# EAGLE design mixer-board3 (EAGLE 9.6.2)
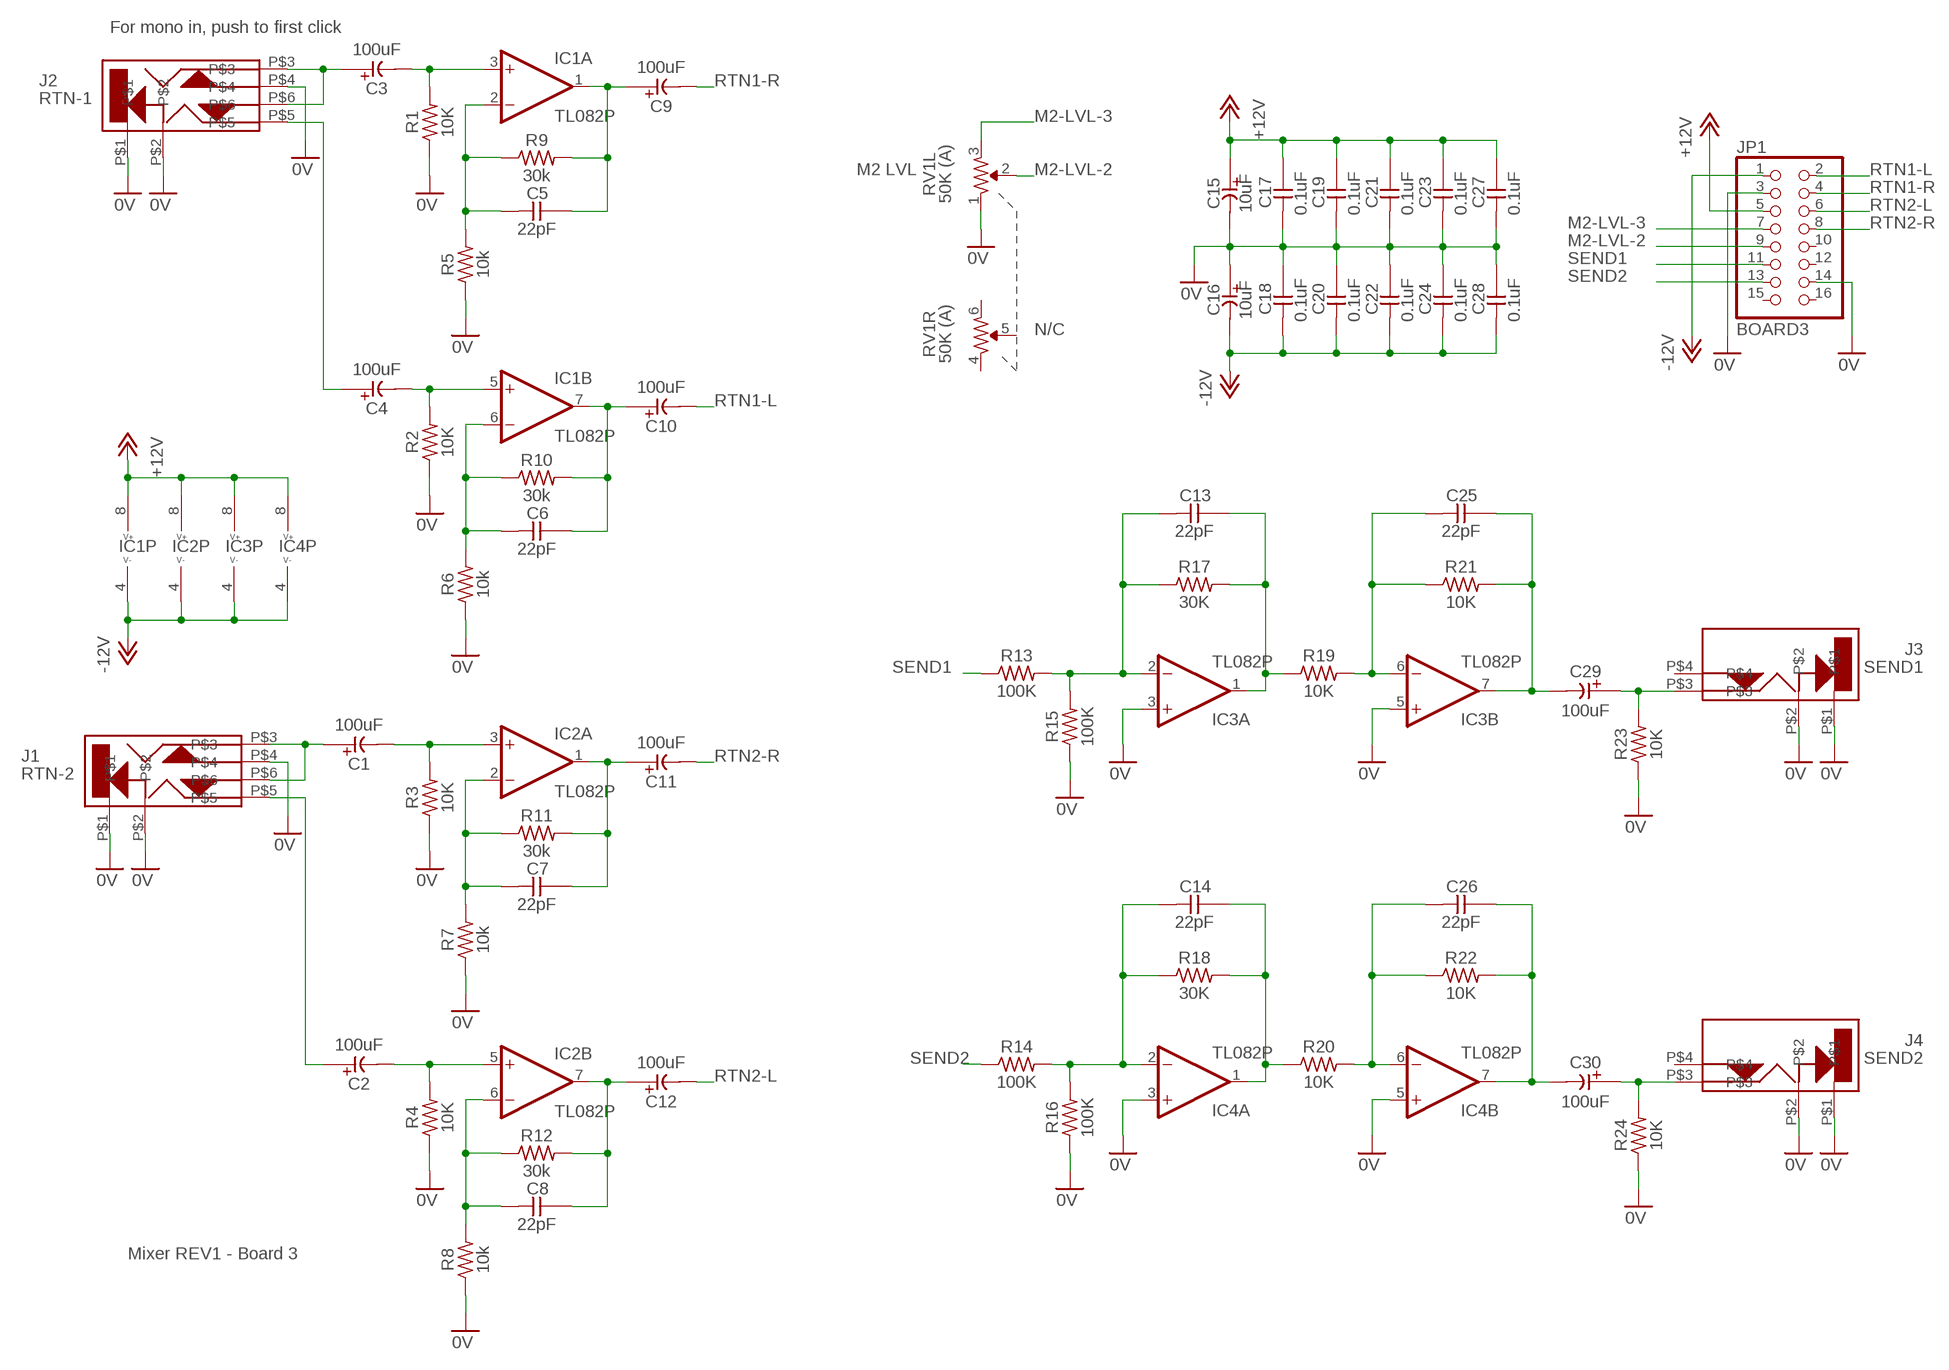
[diagram p0: schematic, sheet 1]

## Parts
C1  100uF  CE-USE5-8.5  [E5-8,5]
C2  100uF  CE-USE5-8.5  [E5-8,5]
C3  100uF  CE-USE5-8.5  [E5-8,5]
C4  100uF  CE-USE5-8.5  [E5-8,5]
C5  22pF  CC-US025-024X044  [C025-024X044]
C6  22pF  CC-US025-024X044  [C025-024X044]
C7  22pF  CC-US025-024X044  [C025-024X044]
C8  22pF  CC-US025-024X044  [C025-024X044]
C9  100uF  CE-USE5-8.5  [E5-8,5]
C10  100uF  CE-USE5-8.5  [E5-8,5]
C11  100uF  CE-USE5-8.5  [E5-8,5]
C12  100uF  CE-USE5-8.5  [E5-8,5]
C13  22pF  CC-US025-024X044  [C025-024X044]
C14  22pF  CC-US025-024X044  [C025-024X044]
C15  10uF  CE-USE2-5  [E2-5]
C16  10uF  CE-USE2-5  [E2-5]
C17  0.1uF  CC-US025-024X044  [C025-024X044]
C18  0.1uF  CC-US025-024X044  [C025-024X044]
C19  0.1uF  CC-US025-024X044  [C025-024X044]
C20  0.1uF  CC-US025-024X044  [C025-024X044]
C21  0.1uF  CC-US025-024X044  [C025-024X044]
C22  0.1uF  CC-US025-024X044  [C025-024X044]
C23  0.1uF  CC-US025-024X044  [C025-024X044]
C24  0.1uF  CC-US025-024X044  [C025-024X044]
C25  22pF  CC-US025-024X044  [C025-024X044]
C26  22pF  CC-US025-024X044  [C025-024X044]
C27  0.1uF  CC-US025-024X044  [C025-024X044]
C28  0.1uF  CC-US025-024X044  [C025-024X044]
C29  100uF  CE-USE5-8.5  [E5-8,5]
C30  100uF  CE-USE5-8.5  [E5-8,5]
IC1  TL082P  [DIL08]
IC2  TL082P  [DIL08]
IC3  TL082P  [DIL08]
IC4  TL082P  [DIL08]
J1  RTN-2  NYS216-U  [NYS216-U]
J2  RTN-1  NYS216-U  [NYS216-U]
J3  SEND1  NYS2162-U  [NYS2162-U]
J4  SEND2  NYS2162-U  [NYS2162-U]
JP1  BOARD3  PINHD-2X8  [2X08]
R1  10K  R  [0207/7]
R2  10K  R  [0207/7]
R3  10K  R  [0207/7]
R4  10K  R  [0207/7]
R5  10k  R  [0207/7]
R6  10k  R  [0207/7]
R7  10k  R  [0207/7]
R8  10k  R  [0207/7]
R9  30k  R  [0207/7]
R10  30k  R  [0207/7]
R11  30k  R  [0207/7]
R12  30k  R  [0207/7]
R13  100K  R  [0207/7]
R14  100K  R  [0207/7]
R15  100K  R  [0207/7]
R16  100K  R  [0207/7]
R17  30K  R  [0207/7]
R18  30K  R  [0207/7]
R19  10K  R  [0207/7]
R20  10K  R  [0207/7]
R21  10K  R  [0207/7]
R22  10K  R  [0207/7]
R23  10K  R  [0207/7]
R24  10K  R  [0207/7]
RV1  50K (A)  R-VAR-ST  [_COMMON_3RP/1610G]

## Nets
0V [power]: C15.- C16.+ C17.2 C18.1 C19.2 C20.1 C21.2 C22.1 C23.2 C24.1 C27.2 C28.1 IC3.3(A:+IN) IC3.5(B:+IN) IC4.3(A:+IN) IC4.5(B:+IN) J1.P$1 J1.P$2 J1.P$4 J2.P$1 J2.P$2 J2.P$4 J3.P$1 J3.P$2 J4.P$1 J4.P$2 JP1.3 JP1.14 R1.1 R2.1 R3.1 R4.1 R5.1 R6.1 R7.1 R8.1 R15.1 R16.1 R23.1 R24.1 RV1.1
+12V [power]: C15.+ C17.1 C19.1 C21.1 C23.1 C27.1 IC1.8(P:V+) IC2.8(P:V+) IC3.8(P:V+) IC4.8(P:V+) JP1.5
-12V [power]: C16.- C18.2 C20.2 C22.2 C24.2 C28.2 IC1.4(P:V-) IC2.4(P:V-) IC3.4(P:V-) IC4.4(P:V-) JP1.1
M2-LVL-2: JP1.9 RV1.2
M2-LVL-3: JP1.7 RV1.3
N$1: C3.+ J2.P$3 J2.P$6
N$2: C4.+ J2.P$5
N$3: C6.2 IC1.6(B:-IN) R6.2 R10.1
N$4: C6.1 C10.+ IC1.7(B:OUT) R10.2
N$6: C3.- IC1.3(A:+IN) R1.2
N$7: C5.2 IC1.2(A:-IN) R5.2 R9.1
N$9: C5.1 C9.+ IC1.1(A:OUT) R9.2
N$10: C4.- IC1.5(B:+IN) R2.2
N$13: C7.2 IC2.2(A:-IN) R7.2 R11.1
N$14: C7.1 C11.+ IC2.1(A:OUT) R11.2
N$15: C1.- IC2.3(A:+IN) R3.2
N$16: C2.- IC2.5(B:+IN) R4.2
N$17: C8.2 IC2.6(B:-IN) R8.2 R12.1
N$18: C8.1 C12.+ IC2.7(B:OUT) R12.2
N$19: C1.+ J1.P$3 J1.P$6
N$20: C2.+ J1.P$5
N$21: C13.2 IC3.2(A:-IN) R13.2 R15.2 R17.1
N$22: C13.1 IC3.1(A:OUT) R17.2 R19.1
N$23: C25.2 IC3.6(B:-IN) R19.2 R21.1
N$24: C25.1 C29.- IC3.7(B:OUT) R21.2
N$25: C14.2 IC4.2(A:-IN) R14.2 R16.2 R18.1
N$26: C14.1 IC4.1(A:OUT) R18.2 R20.1
N$27: C26.2 IC4.6(B:-IN) R20.2 R22.1
N$28: C26.1 C30.- IC4.7(B:OUT) R22.2
OUT-LVL-1: C30.+ J4.P$3 R24.2
OUT-LVL-6: C29.+ J3.P$3 R23.2
RTN1-L: C10.- JP1.2
RTN1-R: C9.- JP1.4
RTN2-L: C12.- JP1.6
RTN2-R: C11.- JP1.8
SEND1: JP1.11 R13.1
SEND2: JP1.13 R14.1
Unconnected: J3.P$4 J4.P$4 JP1.10 JP1.12 JP1.15 JP1.16 RV1.4 RV1.5 RV1.6

## Notes on the sheet
- For mono in, push to first click
- M2 LVL
- N/C
- Mixer REV1 - Board 3

## Library data of the parts
C1-C4 C9-C12 C29 C30 = _common:CE-US: ELECTROLYTIC CAPACITOR, US symbol
C5-C8 C13 C14 C25 C26 = _common:CC-US: CAPACITOR, US symbol
C15 C16 = _common.v1:CE-US: ELECTROLYTIC CAPACITOR, US symbol
C17-C24 C27 C28 = _common.v1:CC-US: CAPACITOR, US symbol
IC1-IC4 = _common:TL082: OP AMP
J1 J2 = jacks:NYS216-U: https://www.mouser.ca/ProductDetail/REAN/NYS216-U Stereo (TRS) 1/4" Jack
J3 J4 = jacks:NYS2162-U: https://www.mouser.ca/ProductDetail/REAN/NYS2162-U Mono (TS) 1/4" Jack
JP1 = pinhead:PINHD-2X8: PIN HEADER
R1-R24 = _common:R: RESISTOR, US symbol
RV1 = _common:R-VAR-ST

## Net classes
0 default: width 0.305 mm, clearance 0.305 mm
1 power: width 0.711 mm, clearance 0.305 mm

## Board
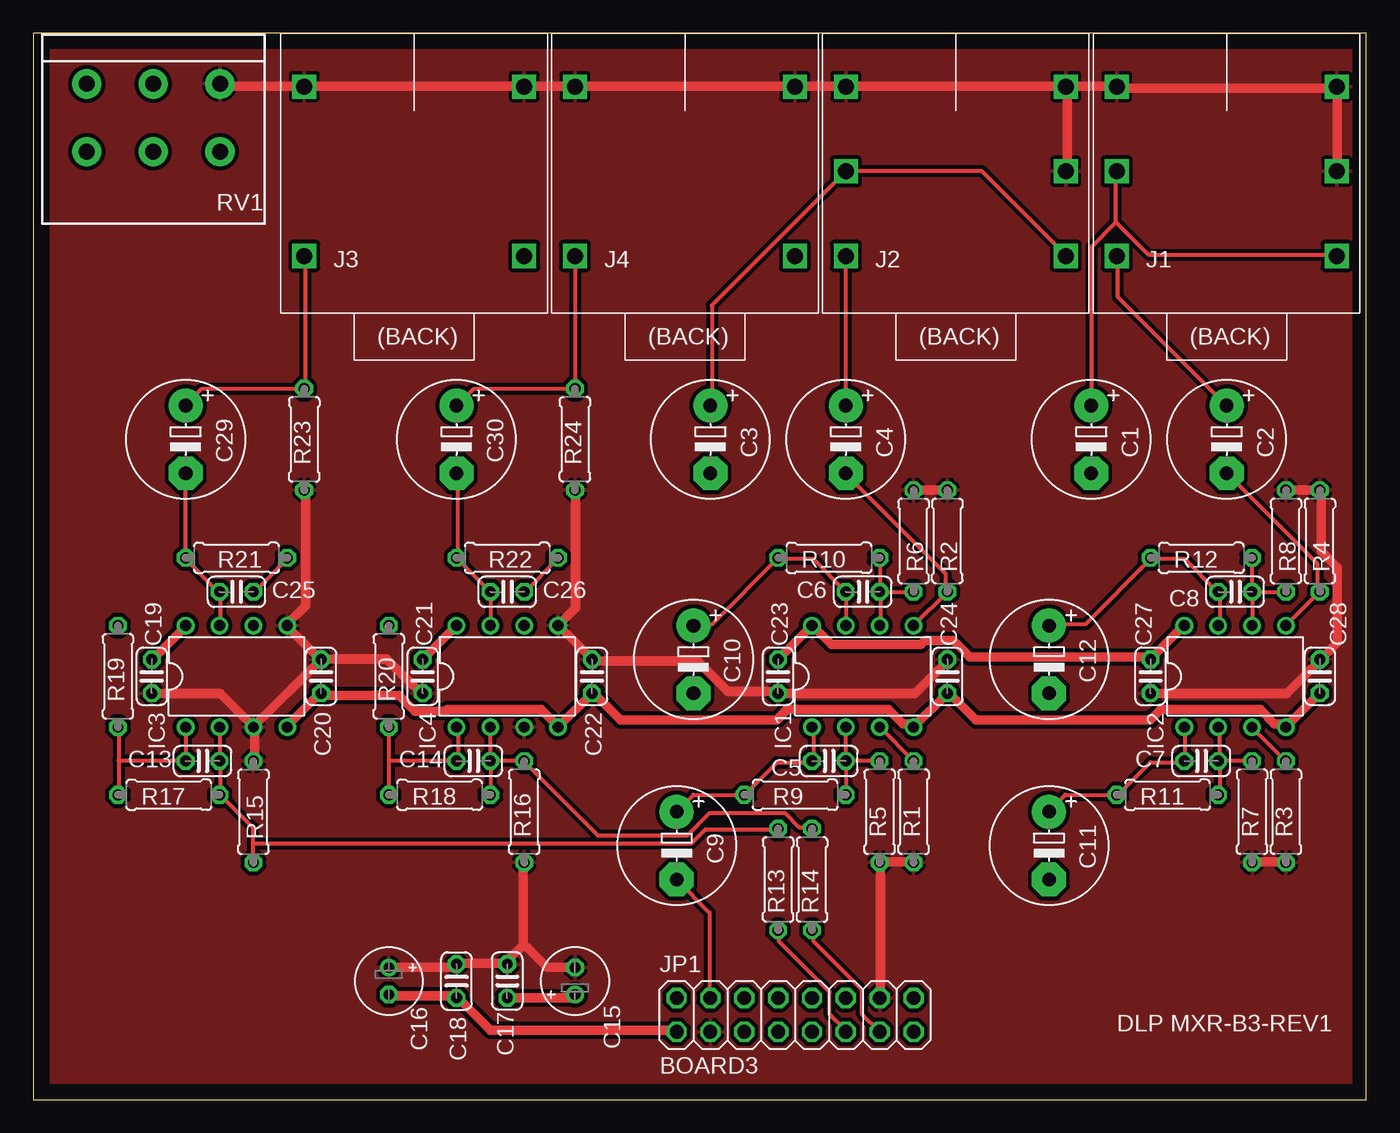
[diagram p1: board, top side]
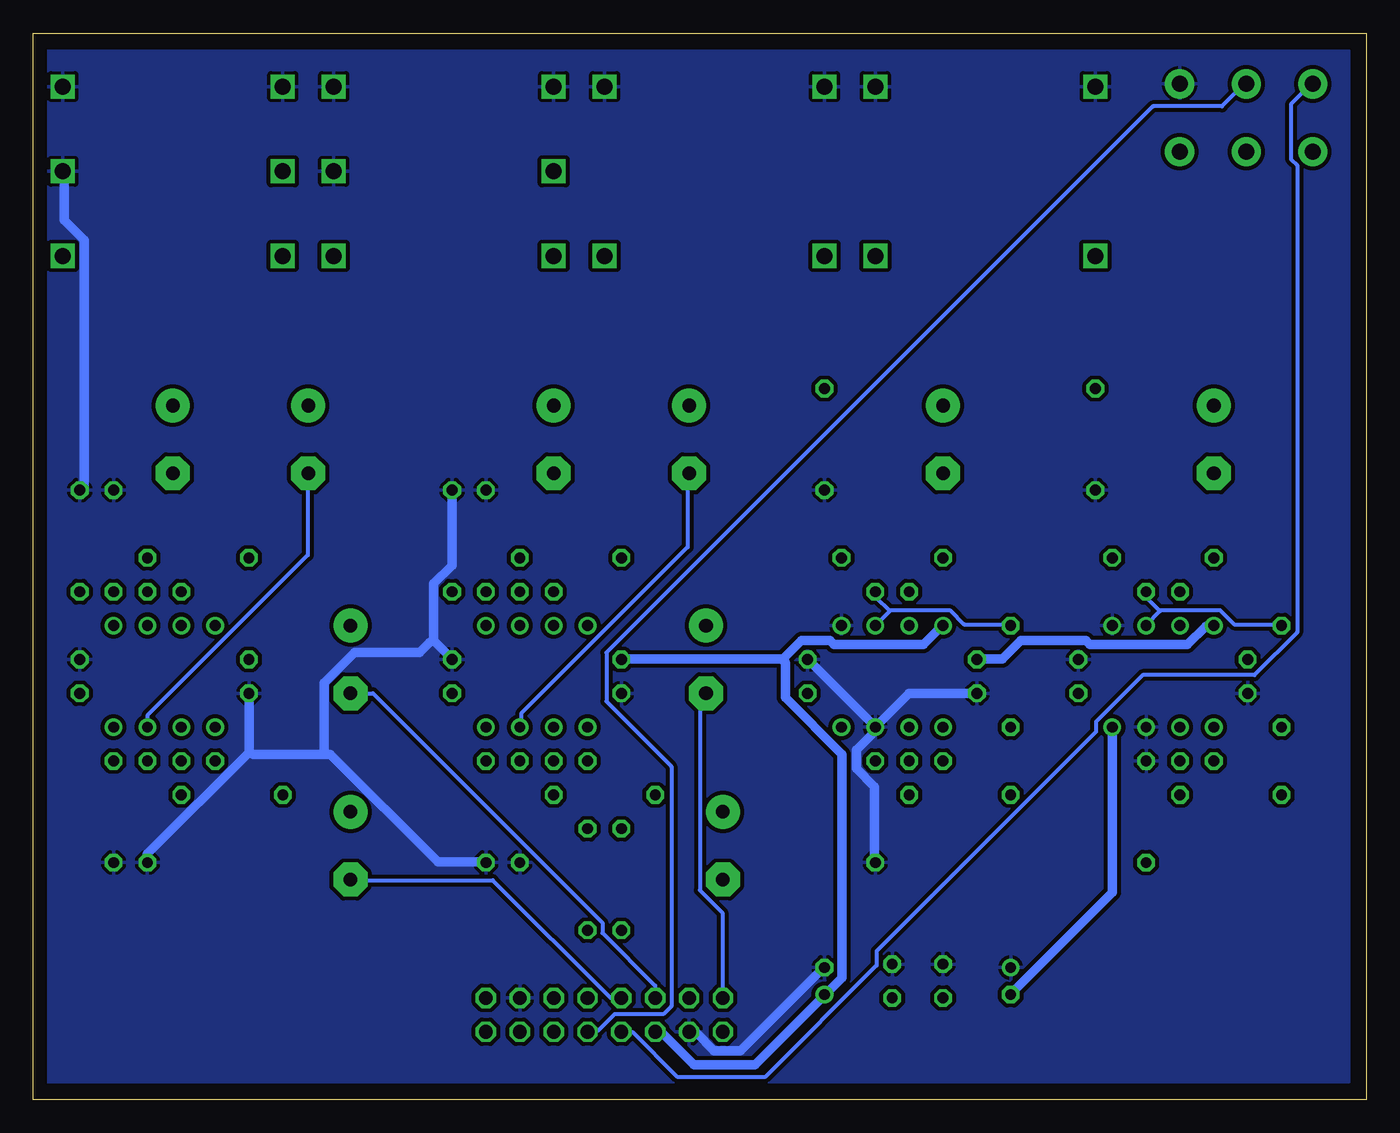
[diagram p2: board, bottom side, seen from below]

Size 100 x 80 mm. Coordinates in mm from the lower left corner, seen from the top.
Outline: 0,0 100,0 100,80 0,80 0,0
Copper layers (1*16): Top 0.035mm / dielectric 1.5mm / Bottom 0.035mm
Design rules "default": minimum track width 6mil, minimum drill 0.35mm, track to track 6mil, track to pad 6mil, pad to pad 6mil, via to via 6mil, smd to smd 6mil, copper to edge 40mil, drill to drill 6mil, minimum pad ring 10mil, minimum via ring 8mil, stop-mask expansion 4mil, vias tented up to drill 0mil, thermal gap 10mil

### Footprints (pad centres in the part's own frame; a part is rotated, then mirrored left to right if it is on the bottom)
E5-8,5 = drill 1.016 pad 2.54: + -2.54,0 | drill 1.016 pad 2.54 octagon: - 2.54,0
C025-024X044 = drill 0.813 octagon: 1 -1.27,0; 2 1.27,0
E2-5 = drill 0.813 pad 1.27: + -1.016,0 | drill 0.813 pad 1.27 octagon: - 1.016,0
DIL08 = drill 0.813 pad 1.27: 1 -3.81,-3.81; 2 -1.27,-3.81; 3 1.27,-3.81; 4 3.81,-3.81; 5 3.81,3.81; 6 1.27,3.81; 7 -1.27,3.81; 8 -3.81,3.81
NYS216-U = drill 1.2 square: P$1 0,0; P$2 16.5,0; P$3 0,-6.35; P$4 16.5,-6.35; P$5 0,-12.7; P$6 16.5,-12.7
NYS2162-U = drill 1.2 square: P$1 0,0; P$2 16.5,0; P$3 0,-12.7; P$4 16.5,-12.7
2X08 = drill 1.016 octagon: 1 -8.89,-1.27; 2 -8.89,1.27; 3 -6.35,-1.27; 4 -6.35,1.27; 5 -3.81,-1.27; 6 -3.81,1.27; 7 -1.27,-1.27; 8 -1.27,1.27; 9 1.27,-1.27; 10 1.27,1.27; 11 3.81,-1.27; 12 3.81,1.27; 13 6.35,-1.27; 14 6.35,1.27; 15 8.89,-1.27; 16 8.89,1.27
0207/7 = drill 0.813 octagon: 1 -3.81,0; 2 3.81,0
_COMMON_3RP/1610G = drill 1.2 pad 2.184: 1 -5,0; 2 0,0; 3 5,0; 4 -5,5.08; 5 0,5.08; 6 5,5.08

### Placement (x,y rotation side)
C1  79.38,49.53 270 top
C2  89.53,49.53 270 top
C3  50.8,49.53 270 top
C4  60.96,49.53 270 top
C5  59.69,25.4 0 top
C6  62.23,38.1 0 top
C7  87.63,25.4 0 top
C8  90.17,38.1 0 top
C9  48.26,19.05 270 top
C10  49.53,33.02 270 top
C11  76.2,19.05 270 top
C12  76.2,33.02 270 top
C13  12.7,25.4 0 top
C14  33.02,25.4 0 top
C15  40.64,8.89 90 top
C16  26.67,8.89 270 top
C17  35.56,8.89 90 top
C18  31.75,8.89 270 top
C19  8.89,31.75 270 top
C20  21.59,31.75 270 top
C21  29.21,31.75 270 top
C22  41.91,31.75 270 top
C23  55.88,31.75 270 top
C24  68.58,31.75 270 top
C25  15.24,38.1 0 top
C26  35.56,38.1 0 top
C27  83.82,31.75 270 top
C28  96.52,31.75 270 top
C29  11.43,49.53 270 top
C30  31.75,49.53 270 top
IC1  62.23,31.75 0 top
IC2  90.17,31.75 0 top
IC3  15.24,31.75 0 top
IC4  35.56,31.75 0 top
J1  81.28,76 0 top
J2  60.96,76 0 top
J3  20.32,76 0 top
J4  40.64,76 0 top
JP1  57.15,6.35 0 top
R1  66.04,21.59 90 top
R2  68.58,41.91 270 top
R3  93.98,21.59 90 top
R4  96.52,41.91 270 top
R5  63.5,21.59 90 top
R6  66.04,41.91 270 top
R7  91.44,21.59 90 top
R8  93.98,41.91 270 top
R9  57.15,22.86 180 top
R10  59.69,40.64 180 top
R11  85.09,22.86 180 top
R12  87.63,40.64 180 top
R13  55.88,16.51 90 top
R14  58.42,16.51 90 top
R15  16.51,21.59 270 top
R16  36.83,21.59 90 top
R17  10.16,22.86 180 top
R18  30.48,22.86 180 top
R19  6.35,31.75 90 top
R20  26.67,31.75 90 top
R21  15.24,40.64 180 top
R22  35.56,40.64 180 top
R23  20.32,49.53 90 top
R24  40.64,49.53 90 top
RV1  9,76.2 180 top

### Tracks (layer width: path | path; a pad name or v marks a point on that pad's centre or on a via)
0V
  Top 0.711: J1.P$4 97.84,69.8 97.84,75.89 J1.P$2 97.54,75.89 81.53,75.89 J1.P$1 81.23,76.05 77.88,76.05 J2.P$2 | J2.P$4 77.57,69.8 77.57,75.89 J2.P$2 | RV1.1 14.02,76.2 14.17,76.05 20.27,76.05 J3.P$1 20.57,76.05 36.58,76.05 J3.P$2 36.88,76.05 40.54,76.05 J4.P$1 41,76.05 56.84,76.05 J4.P$2 57.15,76.05 60.96,76.05 J2.P$1 61.27,76.05 77.11,76.05 J2.P$2 | R1.1 65.99,17.83 63.55,17.83 R5.1 63.55,17.53 63.55,7.62 JP1.14 | R8.1 R4.1 96.62,45.41 96.62,41.15 97.84,39.93 97.84,34.29 96.77,33.22 C28.1 96.47,32.92 94.03,30.48 C27.2 | R7.1 91.44,17.83 93.88,17.83 R3.1 | C16.+ 31.55,9.91 31.7,10.06 C18.1 32,10.21 35.51,10.21 C17.2 35.66,10.52 36.73,11.58 | 36.73,11.58 36.73,17.68 R16.1 | C15.- 38.56,9.91 37.03,11.43 36.73,11.58 | R15.1 16.61,25.45 16.61,27.89 IC3.3 | C19.2 14.02,30.48 16.31,28.19 IC3.3 | C20.1 21.49,33.07 19.05,35.51 IC3.5 19.2,35.81 20.42,37.03 20.42,45.72 R23.1 | C20.1 IC3.3 | R2.1 R6.1 | C24.1 68.58,32.92 66.14,30.48 C23.2 55.63,30.63 52.12,30.63 49.84,32.92 42.22,32.92 C22.1 41.91,33.07 39.47,35.51 IC4.5 40.69,36.88 40.69,45.72 R24.1 | C20.1 21.95,33.07 26.52,33.07 29.11,30.48 C21.2
  Bottom 0.711: R7.1 91.44,18.44 83.82,26.06 | C27.2 83.82,26.06 | 78.18,25.91 83.52,25.91 83.82,26.06 | 78.18,25.91 77.72,25.91 69.65,17.83 66.14,17.83 R1.1 | JP1.3 50.75,5.03 50.29,5.03 48.92,3.66 46.94,3.66 40.69,9.91 C15.- | R2.1 68.58,40.08 69.95,38.71 69.95,34.44 | 69.95,34.44 68.58,33.07 C24.1 | IC4.3 36.88,28.04 41.91,33.07 C22.1 | C21.2 34.29,30.48 IC4.3 | R16.1 36.88,17.83 36.88,23.47 38.25,24.84 38.25,26.21 36.88,27.58 IC4.3 | 78.18,25.91 78.18,31.24 75.89,33.53 71.02,33.53 70.26,34.29 69.95,34.44 | J1.P$4 97.69,69.65 97.69,65.99 96.16,64.47 96.16,46.02 96.47,45.72 R4.1
  pour Top: 1.27,1.27 99.06,1.27 99.06,78.74 1.27,78.74
  pour Bottom: 1.27,1.27 99.06,1.27 99.06,78.74 1.27,78.74
+12V
  Top 0.711: C17.1 40.39,7.62 C15.+ | IC2.8 86.26,35.51 83.82,33.07 C27.1 83.52,33.22 70.26,33.22 69.04,34.44 66.9,34.44 66.6,34.14 59.89,34.14 58.67,35.36 IC1.8 C23.1 | C19.1 8.99,33.07 11.43,35.51 IC3.8 | IC4.8 C21.1
  Bottom 0.711: JP1.5 53.34,5.03 52.88,5.03 50.44,2.59 45.87,2.59 40.69,7.77 C15.+ 40.39,8.08 39.32,9.14 39.32,25.91 43.59,30.18 43.59,32.77 43.74,33.07 | IC3.8 11.43,35.51 12.04,35.51 13.41,34.14 20.73,34.14 21.03,34.44 25.91,34.44 27.28,33.07 29.11,33.07 C21.1 | 43.74,33.07 55.78,33.07 C23.1 | 43.74,33.07 42.37,34.44 40.23,34.44 39.93,34.14 33.22,34.14 31.85,35.51 IC4.8
-12V
  Top 0.711: C16.- 26.67,7.77 31.55,7.77 31.7,7.62 C18.2 32,7.47 34.29,5.18 48.16,5.18 JP1.1 | C28.2 96.47,30.48 94.03,28.04 IC2.4 93.73,28.19 93.12,28.19 92.05,29.26 84.58,29.26 83.82,28.5 70.71,28.5 68.89,30.33 C24.2 IC1.4 65.84,28.19 65.23,28.19 64.16,29.26 56.54,29.26 55.78,28.5 44.04,28.5 42.22,30.33 C22.2 IC4.4 39.17,28.19 38.1,29.26 31.09,29.26 30.94,29.11 28.65,29.11 27.43,30.33 21.79,30.33 C20.2 21.49,30.48 19.05,28.04 IC3.4
  Bottom 0.711: IC3.4 19.05,15.54 26.67,7.92 C16.-
M2-LVL-2
  Bottom 0.305: JP1.9 58.37,5.18 57.61,5.18 56.39,6.4 52.73,6.4 52.12,7.01 52.12,24.99 57,29.87 57,33.53 16,74.52 10.82,74.52 9.14,76.2 RV1.2
M2-LVL-3
  Bottom 0.305: JP1.7 55.78,5.03 55.02,5.03 51.66,1.68 45.11,1.68 36.73,10.06 36.73,11.12 20.27,27.58 20.27,28.35 16.76,31.85 8.38,31.85 5.18,35.05 5.18,70.1 5.64,70.56 5.64,74.68 4.12,76.2 RV1.3
N$1
  Top 0.305: J2.P$3 71.17,69.65 77.42,63.4 J2.P$6 | J2.P$3 50.9,59.59 50.9,52.12 C3.+ | J2.P$3
N$2
  Top 0.305: C4.+ J2.P$5
N$3
  Top 0.305: 63.55,38.1 63.55,35.66 IC1.6 | 63.55,38.1 63.55,40.54 R10.1 | 63.55,38.1 R6.2 | 63.55,38.1 C6.2
N$4
  Top 0.305: IC1.7 C6.1 58.52,40.54 55.93,40.54 R10.2 50.9,35.66 49.53,35.66 C10.+
N$6
  Top 0.305: IC1.3 R1.2
  Bottom 0.305: IC1.3 63.4,28.04 63.4,28.96 50.9,41.45 50.9,46.94 C3.-
N$7
  Top 0.305: R9.1 C5.2 60.96,25.45 | 60.96,25.45 63.4,25.45 R5.2 | 60.96,25.45 IC1.2
N$9
  Top 0.305: IC1.1 58.52,27.89 58.52,25.45 C5.1 58.37,25.3 55.78,25.3 R9.2 49.53,22.86 C9.+
N$10
  Top 0.305: IC1.5 R2.2 68.43,38.1 68.43,39.47 60.96,46.94 C4.-
N$13
  Top 0.305: R11.1 89,22.86 89,25.3 C7.2 | R7.2 91.44,25.45 89,25.45 C7.2 | IC2.2 89,27.89 89,25.6 C7.2
N$14
  Top 0.305: IC2.1 86.41,27.89 86.41,25.45 C7.1 86.26,25.3 83.82,25.3 81.38,22.86 R11.2 77.42,22.86 76.2,21.64 C11.+
N$15
  Top 0.305: R3.2 93.88,25.45 91.44,27.89 IC2.3
  Bottom 0.305: IC2.3 91.44,28.8 79.4,40.84 79.4,46.94 C1.-
N$16
  Top 0.305: IC2.5 94.03,35.66 96.47,38.1 R4.2 96.32,38.1 96.32,40.23 89.61,46.94 C2.-
N$17
  Top 0.305: C8.2 IC2.6 | C8.2 R12.1 | C8.2 R8.2
N$18
  Top 0.305: 83.82,40.54 86.41,40.54 88.85,38.1 C8.1 89,38.1 89,35.66 IC2.7 | 83.82,40.54 78.94,35.66 76.2,35.66 C12.+ | 83.82,40.54 R12.2
N$19
  Top 0.305: 81.23,65.84 81.23,69.65 J1.P$3 | 81.23,65.84 79.4,64.01 79.4,52.12 C1.+ | 81.23,65.84 83.67,63.4 97.69,63.4 J1.P$6
N$20
  Top 0.305: J1.P$5 81.38,63.25 81.38,60.2 89.46,52.12 C2.+
N$21
  Top 0.305: 14.02,22.86 14.02,25.3 C13.2 14.02,25.45 14.02,27.89 IC3.2 | 16.46,19.2 16.46,20.42 14.02,22.86 | 16.46,19.2 16.46,17.83 R15.2 | 14.02,22.86 R17.1 | 16.46,19.2 49.38,19.2 50.44,20.27 55.78,20.27 R13.2
N$22
  Top 0.305: IC3.1 11.43,25.45 | 6.4,25.45 6.4,27.89 R19.1 | 6.4,25.45 6.4,22.86 R17.2 | 6.4,25.45 11.43,25.45 | 11.43,25.45 C13.1
N$23
  Top 0.305: R21.1 19.05,40.54 16.61,38.1 C25.2
  Bottom 0.305: 15.47,36.65 16.46,35.66 IC3.6 | 15.47,36.65 15.39,36.73 10.97,36.73 9.91,35.66 6.4,35.66 R19.2 | 15.47,36.65 16.46,37.64 16.46,38.1 C25.2
N$24
  Top 0.305: IC3.7 14.02,35.66 14.02,38.1 C25.1 13.87,38.1 11.43,40.54 R21.2 C29.-
N$25
  Top 0.305: R18.1 C14.2 34.29,25.45 | 34.29,25.45 36.73,25.45 R16.2 36.88,25.3 42.37,19.81 49.07,19.81 50.75,21.49 56.39,21.49 57.45,20.42 58.37,20.42 R14.2 | 34.29,25.45 IC4.2
N$26
  Top 0.305: IC4.1 31.85,27.89 31.85,25.45 C14.1 31.7,25.45 26.67,25.45 | R20.1 26.67,25.45 | 26.67,25.45 R18.2
N$27
  Top 0.305: R22.1 39.32,40.54 36.88,38.1 C26.2
  Bottom 0.305: IC4.6 35.74,36.65 | 35.74,36.65 35.66,36.73 31.24,36.73 30.18,35.66 26.67,35.66 R20.2 | 35.74,36.65 36.73,37.64 36.73,38.1 C26.2
N$28
  Top 0.305: IC4.7 C26.1 R22.2 31.85,40.69 31.85,46.94 C30.-
OUT-LVL-1
  Top 0.305: C30.+ 31.85,52.12 33.07,53.34 R24.2 40.69,53.34 40.69,63.25 J4.P$3
OUT-LVL-6
  Top 0.305: C29.+ 11.43,52.12 12.65,53.34 R23.2 20.42,53.34 20.42,63.25 J3.P$3
RTN1-L
  Bottom 0.305: C10.- 49.99,30.02 49.99,15.7 48.31,14.02 48.31,7.62 JP1.2
RTN1-R
  Top 0.305: C9.- 50.75,14.02 50.75,7.62 JP1.4
RTN2-L
  Bottom 0.305: JP1.6 53.34,8.53 57.3,12.5 57.3,13.26 74.52,30.48 C12.-
RTN2-R
  Bottom 0.305: JP1.8 56.69,7.62 65.53,16.46 76.2,16.46 C11.-
SEND1
  Top 0.305: R13.1 55.93,12.65 55.93,11.89 59.74,8.08 59.74,6.4 60.96,5.18 JP1.11
SEND2
  Top 0.305: JP1.13 62.18,6.4 62.18,8.23 58.52,11.89 58.52,12.65 R14.1

### Text on the board
tNames: DLP MXR-B3-REV1 | BOARD3